# EAGLE schematic TriviaTreckSchematic (EAGLE 9.6.2)
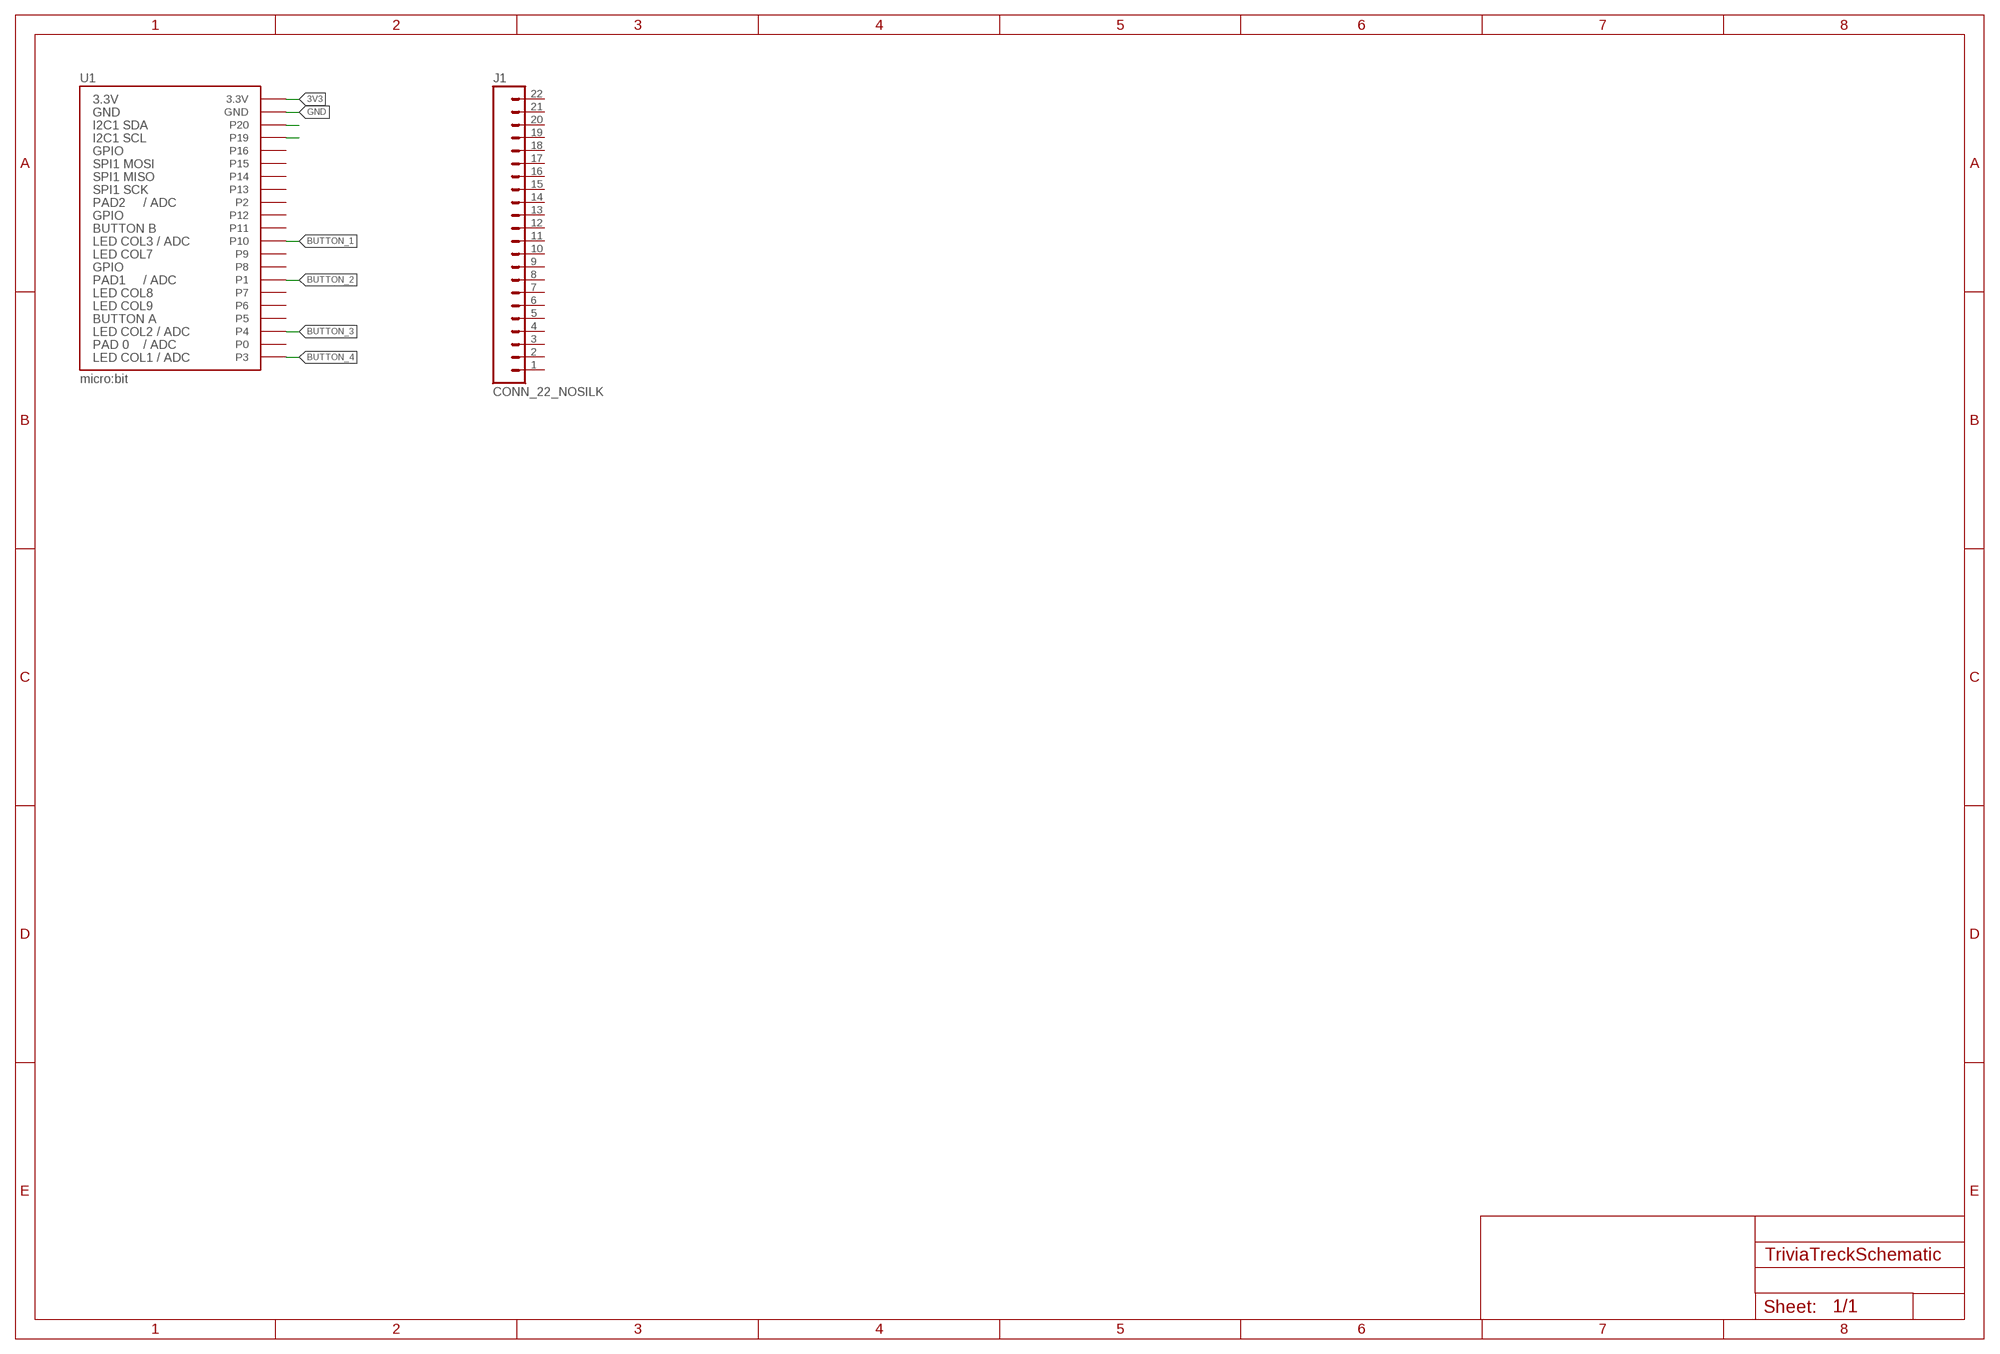
[diagram p0: schematic, sheet 1]

## Parts
J1  CONN_22_NOSILK  [1X22_NOSILK]
U1  micro:bit  MICRO:BIT_RA  [MICRO:BIT-RA_SMD]

## Nets
3V3: U1.P$27(3.3V) U1.P$28(3.3V) U1.P$29(3.3V) U1.P$30(3.3V) U1.P$31(3.3V) U1.P$32(3.3V)
BUTTON_1: U1.P$16(P10)
BUTTON_2: U1.P$10(P1) U1.P$11(P1) U1.P$12(P1) U1.P$13(P1)
BUTTON_3: U1.P$6(P4)
BUTTON_4: U1.P$1(P3)
GND: U1.P$35(GND) U1.P$36(GND) U1.P$37(GND) U1.P$38(GND) U1.P$39(GND) U1.P$40(GND)
N$1: U1.P$34(P20)
N$2: U1.P$33(P19)
Unconnected: J1.1 J1.2 J1.3 J1.4 J1.5 J1.6 J1.7 J1.8 J1.9 J1.10 J1.11 J1.12 J1.13 J1.14 J1.15 J1.16 J1.17 J1.18 J1.19 J1.20 J1.21 J1.22 U1.P$2(P0) U1.P$3(P0) U1.P$4(P0) U1.P$5(P0) U1.P$7(P5) U1.P$8(P6) U1.P$9(P7) U1.P$14(P8) U1.P$15(P9) U1.P$17(P11) U1.P$18(P12) U1.P$19(P2) U1.P$20(P2) U1.P$21(P2) U1.P$22(P2) U1.P$23(P13) U1.P$24(P14) U1.P$25(P15) U1.P$26(P16)

## Library data of the parts
J1 = SparkFun-Connectors:CONN_22: Standard 22-pin 0.1" header; PROD_ID: CONN-13453
U1 = SparkFun-Connectors:MICRO:BIT*?; PROD_ID: CONN-14679